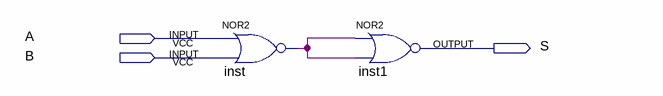
[diagram p0: schematic sheet]
// Quartus schematic nor_or.bdf as structural Verilog: 2 symbols, 3 pins
module nor_or (
  input  A,
  input  B,
  output S
);

  wire inst_out;

  nor inst (inst_out, A, B);
  nor inst1 (S, inst_out, inst_out);
endmodule
